# Altium schematic sheet ESP32.SchDoc
size B
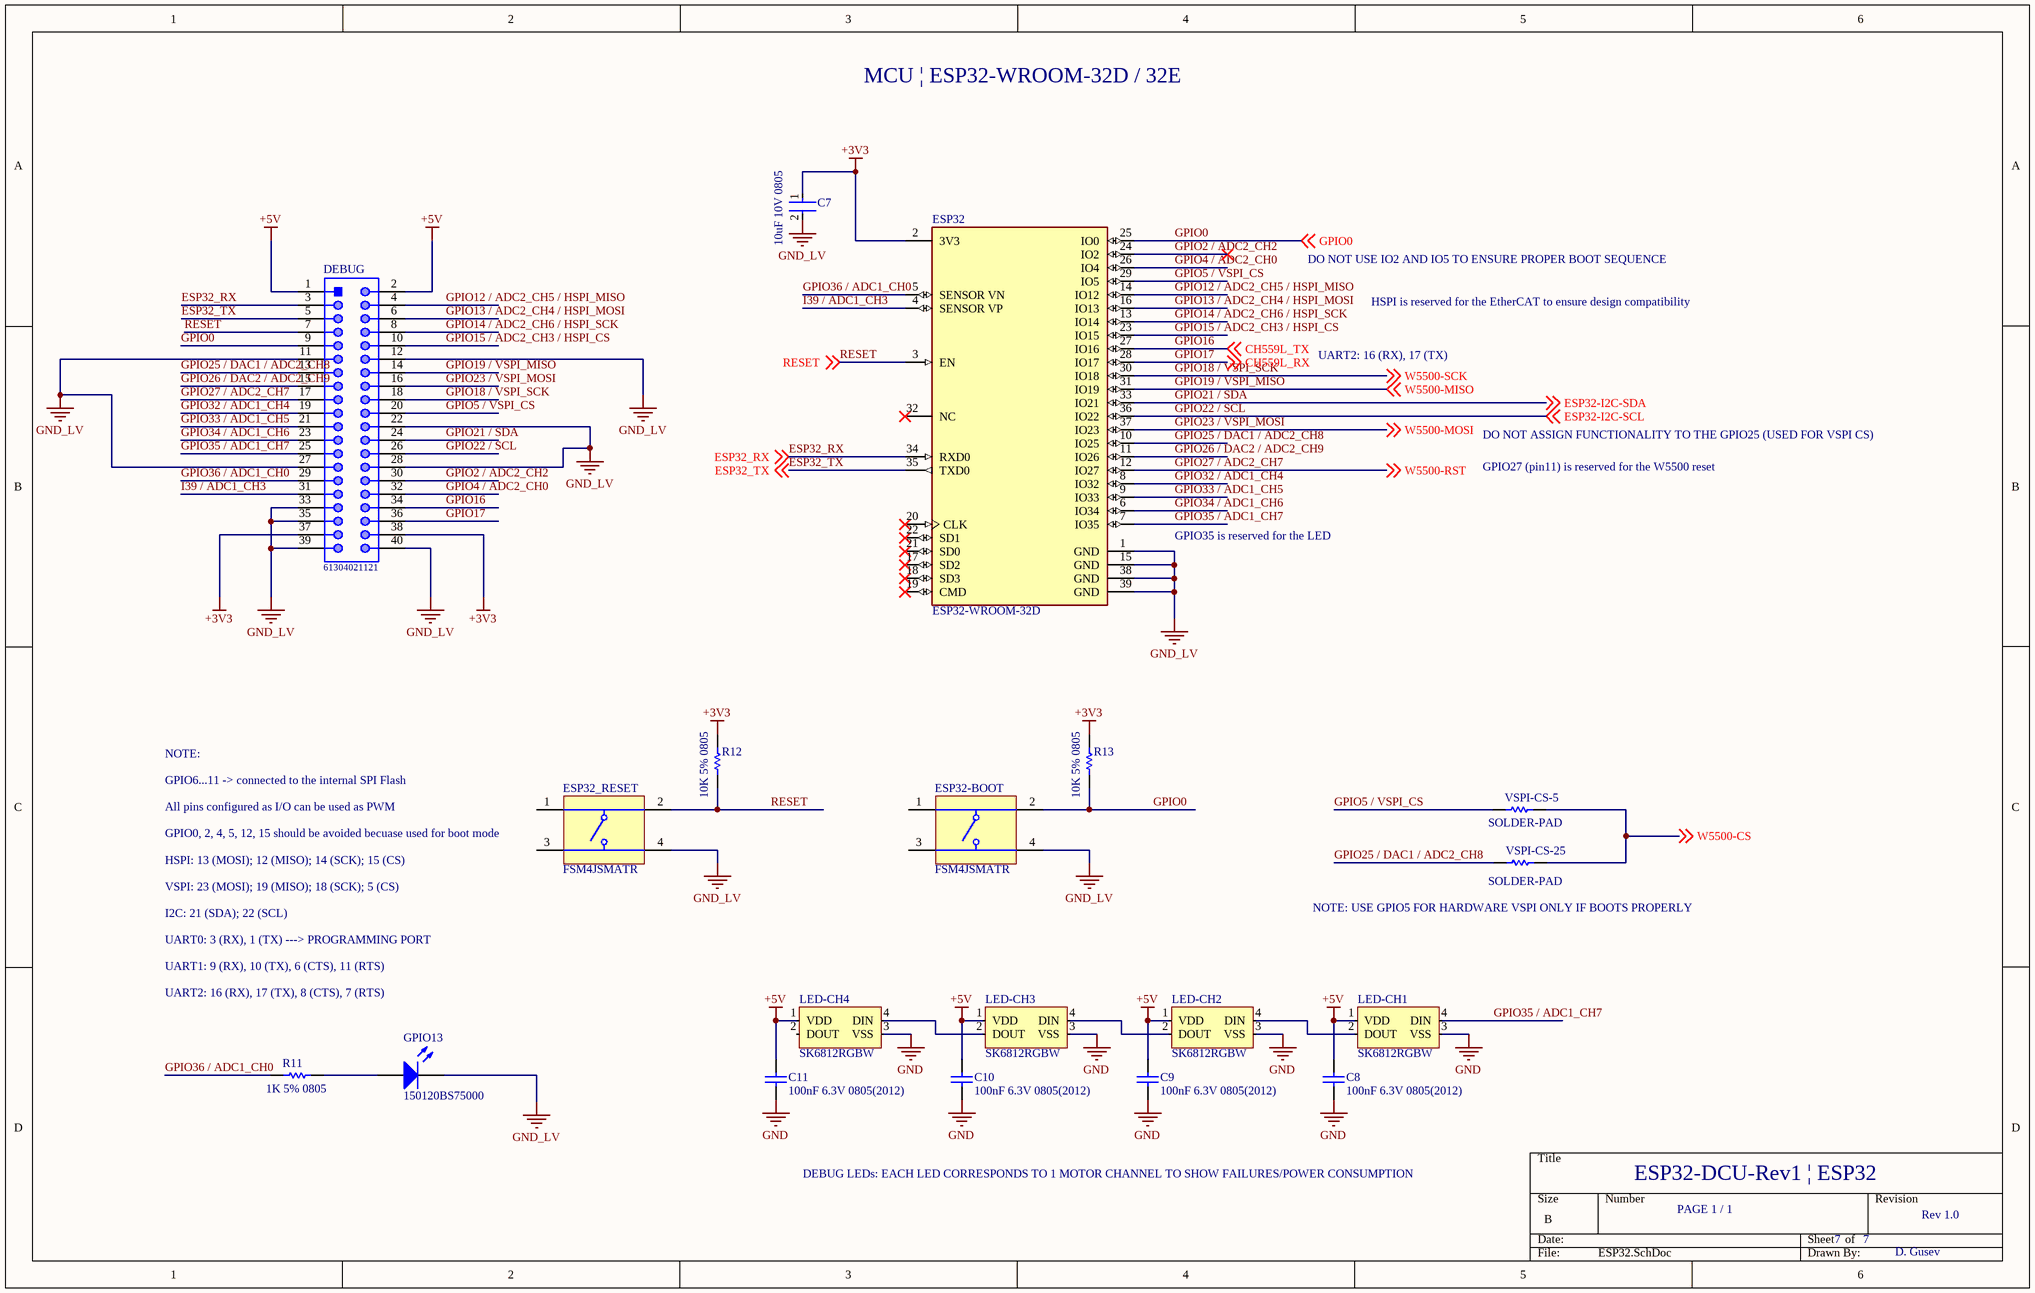
[diagram p0: ESP32.SchDoc]

## Parts
C7  10uF 10V 0805  [FP-C0805C-DG-MFG]
C8  100nF 6.3V 0805(2012)  [CAPC0805(2012)100_N]
C9  100nF 6.3V 0805(2012)  [CAPC0805(2012)100_N]
C10  100nF 6.3V 0805(2012)  [CAPC0805(2012)100_N]
C11  100nF 6.3V 0805(2012)  [CAPC0805(2012)100_N]
DEBUG  61304021121  [61304021121]
ESP32  ESP32-WROOM-32D  [FP-ESP32-WROOM-32D-MFG]
ESP32-BOOT  FSM4JSMATR  [TECO-FSM4JSMATR_V]
ESP32_RESET  FSM4JSMATR  [TECO-FSM4JSMATR_V]
GPIO13  150120BS75000  [1206_A]
LED-CH1  SK6812RGBW  [SK6812RGBW]
LED-CH2  SK6812RGBW  [SK6812RGBW]
LED-CH3  SK6812RGBW  [SK6812RGBW]
LED-CH4  SK6812RGBW  [SK6812RGBW]
R11  1K 5% 0805  [RESC2013X60X40ML20T25]
R12  10K 5% 0805  [RESC2013X60X40ML20T25]
R13  10K 5% 0805  [RESC2013X60X40ML20T25]
VSPI-CS-5  SOLDER-PAD  [RESC2013X60X35LL10T20]
VSPI-CS-25  SOLDER-PAD  [RESC2013X60X35LL10T20]

## Nets
+3V3: C7.1 DEBUG.37 DEBUG.38 ESP32.2(3V3) R12.2 R13.2
+5V: C8.2 C9.2 C10.2 C11.2 DEBUG.1 DEBUG.2 LED-CH1.1(VDD) LED-CH2.1(VDD) LED-CH3.1(VDD) LED-CH4.1(VDD)
GND: C8.1 C9.1 C10.1 C11.1 LED-CH1.3(VSS) LED-CH2.3(VSS) LED-CH3.3(VSS) LED-CH4.3(VSS)
GND_LV: C7.2 DEBUG.11 DEBUG.12 DEBUG.22 DEBUG.27 DEBUG.28 DEBUG.33 DEBUG.35 DEBUG.39 DEBUG.40 ESP32.1(GND) ESP32.15(GND) ESP32.38(GND) ESP32.39(GND) ESP32-BOOT.4 ESP32_RESET.4 GPIO13.1(K)
ESP32_RX: DEBUG.3 ESP32.34(RXD0) ; off-sheet ESP32_RX
ESP32_TX: DEBUG.5 ESP32.35(TXD0) ; off-sheet ESP32_TX
GPIO0: DEBUG.9 ESP32.25(IO0) ESP32-BOOT.2 R13.1 ; off-sheet GPIO0
GPIO2 / ADC2_CH2: DEBUG.30 ESP32.24(IO2)
GPIO4 / ADC2_CH0: DEBUG.32 ESP32.26(IO4)
GPIO5 / VSPI_CS: DEBUG.20 ESP32.29(IO5) VSPI-CS-5.1
GPIO12 / ADC2_CH5 / HSPI_MISO: DEBUG.4 ESP32.14(IO12)
GPIO13 / ADC2_CH4 / HSPI_MOSI: DEBUG.6 ESP32.16(IO13)
GPIO14 / ADC2_CH6 / HSPI_SCK: DEBUG.8 ESP32.13(IO14)
GPIO15 / ADC2_CH3 / HSPI_CS: DEBUG.10 ESP32.23(IO15)
GPIO16: DEBUG.34 ESP32.27(IO16) ; off-sheet CH559L_TX  [also labelled CH559L_TX]
GPIO17: DEBUG.36 ESP32.28(IO17) ; off-sheet CH559L_RX  [also labelled CH559L_RX]
GPIO18 / VSPI_SCK: DEBUG.18 ESP32.30(IO18) ; off-sheet W5500-SCK  [also labelled W5500-SCK]
GPIO19 / VSPI_MISO: DEBUG.14 ESP32.31(IO19) ; off-sheet W5500-MISO  [also labelled W5500-MISO]
GPIO21 / SDA: DEBUG.24 ESP32.33(IO21) ; off-sheet ESP32-I2C-SDA  [also labelled ESP32-I2C-SDA]
GPIO22 / SCL: DEBUG.26 ESP32.36(IO22) ; off-sheet ESP32-I2C-SCL  [also labelled ESP32-I2C-SCL]
GPIO23~{ }/ VSPI_MOSI: DEBUG.16 ESP32.37(IO23) ; off-sheet W5500-MOSI  [also labelled W5500-MOSI]
GPIO25 / DAC1 / ADC2_CH8: DEBUG.13 ESP32.10(IO25) VSPI-CS-25.1
GPIO26 / DAC2 / ADC2_CH9: DEBUG.15 ESP32.11(IO26)
GPIO27 / ADC2_CH7: DEBUG.17 ESP32.12(IO27) ; off-sheet W5500-RST  [also labelled W5500-RST]
GPIO32 / ADC1_CH4: DEBUG.19 ESP32.8(IO32)
GPIO33 / ADC1_CH5: DEBUG.21 ESP32.9(IO33)
GPIO34 / ADC1_CH6: DEBUG.23 ESP32.6(IO34)
GPIO35 / ADC1_CH7: DEBUG.25 ESP32.7(IO35) LED-CH1.4(DIN)
GPIO36 / ADC1_CH0: DEBUG.29 ESP32.5(SENSOR_VN) R11.1
I39 / ADC1_CH3: DEBUG.31 ESP32.4(SENSOR_VP)
RESET: DEBUG.7 ESP32.3(EN) ESP32_RESET.2 R12.1 ; off-sheet RESET
W5500-CS: VSPI-CS-5.2 VSPI-CS-25.2 ; off-sheet W5500-CS
NetGPIO13_2: GPIO13.2(A) R11.2
NetLED-CH1_2: LED-CH1.2(DOUT) LED-CH2.4(DIN)
NetLED-CH2_2: LED-CH2.2(DOUT) LED-CH3.4(DIN)
NetLED-CH3_2: LED-CH3.2(DOUT) LED-CH4.4(DIN)

Not connected (* = marked no-connect by the designer): ESP32 17(SD2)* 18(SD3)* 19(CMD)* 20(CLK)* 21(SD0)* 22(SD1)* 32(NC)*; ESP32-BOOT 1 3; ESP32_RESET 1 3; LED-CH4 2(DOUT)

## Notes on the sheet
- MCU | ESP32-WROOM-32D / 32E
- DO NOT USE IO2 AND IO5 TO ENSURE PROPER BOOT SEQUENCE
- UART2: 16 (RX), 17 (TX)
- HSPI is reserved for the EtherCAT to ensure design compatibility
- DO NOT ASSIGN FUNCTIONALITY TO THE GPIO25 (USED FOR VSPI CS)
- GPIO27 (pin11) is reserved for the W5500 reset
- GPIO35 is reserved for the LED
- NOTE:
- GPIO6...11 -> connected to the internal SPI Flash
- All pins configured as I/O can be used as PWM
- (near ESP32_RESET) GPIO0, 2, 4, 5, 12, 15 should be avoided becuase used for boot mode
- HSPI: 13 (MOSI); 12 (MISO); 14 (SCK); 15 (CS)
- VSPI: 23 (MOSI); 19 (MISO); 18 (SCK); 5 (CS)
- (near VSPI-CS-25) NOTE: USE GPIO5 FOR HARDWARE VSPI ONLY IF BOOTS PROPERLY
- I2C: 21 (SDA); 22 (SCL)
- UART0: 3 (RX), 1 (TX) ---> PROGRAMMING PORT
- UART1: 9 (RX), 10 (TX), 6 (CTS), 11 (RTS)
- UART2: 16 (RX), 17 (TX), 8 (CTS), 7 (RTS)
- DEBUG LEDs: EACH LED CORRESPONDS TO 1 MOTOR CHANNEL TO SHOW FAILURES/POWER CONSUMPTION
- ESP32-DCU-Rev1 | ESP32
- PAGE 1 / 1
- 7
- Rev 1.0
- D. Gusev

## Library data of the parts
C7 = CMP-2007-03243-2: CAP CER 10UF 10V X5R 0805; Manufacturer Part Number: C0805C106K8PACTU; Manufacturer: Kemet; 3DS Part Number: 220-00001; Tolerance: 10%; Temperature Coefficient: 15%; Material: Ceramic; Device Class L2: Capacitors; Device Class L1: Passive Components; ComponentLink2URL: https://content.kemet.com/datasheets/KEM_C1006_X5R_SMD.pdf; Height: 1.4mm; Lead Free: Yes; Digikey Description: CAP CER 10UF 10V X5R 0805; Octopart: https://octopart.com/c0805c106k8pactu-kemet-98697; Capacitance: 10uF; Value: 10uF; Temperature Range Low: -55°C; Temperature: -55°C to +85°C; Automotive: No; Mouser Description: CAP CER 10UF 10V X5R 0805; Ipc Land Pattern Name: CAPC200125X125; Temperature Range High: +85°C; Voltage: 10V; RoHS: TRUE; Device Class L3: Ceramic Capacitors; ComponentLink2Description: Datasheet; Voltage Rating: 10V; Package: C0805C-DG; Temperature Characteristic: X5R; Category: Cap
C8-C11 = CMP-1036-04392-1: CAP 100nF 6.3V ±20% 0805 (2012 Metric) Thickness 1mm SMD; Tolerance: Â±20%; Case-Metric: 2012; Case-EIA: 0805; Max Thickness: 1 mm; Technology: SMT; Value: 100nF; Rated Voltage: 6.3 V
DEBUG = CMP-1502-01135-1: THT Vertical Pin Header WR-PHD, Pitch 2.54 mm, Dual Row, 40 pins; Manufacturer: Wurth Elektronik; Contact Resistance: 20mOhm; Pitch: 2.54mm; Pin Number: 40; Withstanding Voltage: 500VAC; Gender: Male; Rated Current: 3A; Working Voltage: 250VAC; Operating Temperature: -40to105degC; Manufacturer URL: http://www.we-online.de; Orientation: Vertical; Datasheet URL: https://katalog.we-online.de/em/datasheet/6130xx21121.pdf; Package Reference: 61304021121; Row Number: Dual; Part Number: 61304021121; Packaging: Bag; Mounting Technology: THT; Publisher: WurthElektronik
ESP32 = CMP-194065-000003-1: WIFI MODULE 32MBITS SPI FLASH; Manufacturer: Espressif Systems; Max Supply Voltage: 3.6V; Nominal Supply Current: 500mA; Max Frequency: 2484MHz; Number Of Adc Channels: 16; Number Of Gpio: 32; Interface: I2C,SPI,UART,Ethernet,I2S,Other; Data Rate: 150Mbits/s; Min Supply Voltage: 3V; Bandwidth: 72MHz; Sensitivity: -98dBm; Octopart: https://octopart.com/esp32-wroom-32d-espressif+systems-91040050; Package: ESP32-WROOM-32D; ComponentLink2URL: https://www.espressif.com/sites/default/files/documentation/esp32-wroom-32d_esp32-wroom-32u_datasheet_en.pdf; Lead Free: Yes; Category: UNK; Mouser Description: Wi-Fi/BT BLE Module ESP32-D0WD, SPI Flash, UART, P; Device Class L1: Integrated Circuits (ICs); RoHS: TRUE; Temperature Range Low: -40°C; ComponentLink2Description: Datasheet; Digikey Description: WIFI MODULE 32MBITS SPI FLASH; Height: 3.2mm; Temperature: -40°C to +85°C; Manufacturer Part Number: ESP32-WROOM-32D; Device Class L3: Transceivers; Device Class L2: RF Semiconductors and Devices; Temperature Range High: +85°C; Automotive: No
ESP32-BOOT ESP32_RESET = CMP-2000-07486-1: Micro Miniature Push Button Switch FSM JSM, 50 mA, -35 to 85 degC, 4-Pin SMD, RoHS, Tape and Reel; Manufacturer: TE Connectivity; Mechanical Life: 100000Cycles; Current Rating: 50mA; Actuator Material: Polyamide; Max Voltage Rating (DC): 12V; Capacitance: 0f; Illumination Type: Illuminated; Voltage Rating (DC): 24V; Case\/Package: SMD/SMT; Operating Force: 160gf; Contact Resistance: 100mOhm; Actuator Length: 0.055inch; Switch Travel: 0.25mm; Throw Configuration: SPST; Termination: GullWing; Contact Plating: Silver; Orientation: Straight; Mounting Technology: SurfaceMount; REACH SVHC: Unknown; Electrical Life: 100000Cycles; Package Reference: FSM4JSMATR; Max Operating Temperature: 85degC; Manufacturer URL: http://www.te.com/; Package Description: 4-Pin Surface Mount Device, Body 6 x 6 mm, Pitch 4.5 mm; Datasheet Version: Rev. V, 02/2015; Packaging: TapeandReel; Min Operating Temperature: -35degC; Mount: SurfaceMount; Contact Current Rating: 50mA; Contact Material: CopperAlloy; Package Quantity: 1200; Datasheet URL: http://www.te.com/commerce/DocumentDelivery/DDEController?Action=showdoc&DocId=Customer+Drawing%7F2-1437565-7%7FV%7Fpdf%7FEnglish%7FENG_CD_2-1437565-7_V.pdf%7F4-1437565-2; RoHSCompliant: true
GPIO13 = CMP-1426-00015-1: SMD mono-color Chip LED, WL-SMCW, Blue; Manufacturer: Wuerth Elektronik; ComponentLink2Description: Datasheet; ComponentLink1URL: http://www.we-online.com; PartNumber: 150120BS75000; ComponentLink1Description: Manufacturer URL; ComponentLink2URL: http://katalog.we-online.com/led/datasheet/150120BS75000.pdf; PackageReference: 1206_A; Color: Blue
R11-R13 = CMP-2001-00590-1: Part Number: ERA6AEB123V; Manufacturer: Panasonic
VSPI-CS-5 VSPI-CS-25 = CMP-1659-00014-4: Chip Resistor, 1 Ohm, +/- 1%, 125 mW, -55 to 155 degC, 0805 (2012 Metric), RoHS, Tape and Reel; Manufacturer: Yageo; Voltage Rating: 150 V; REACH SVHC: No SVHC; Mounting Technology: Surface Mount; RoHSCompliant: true; Packaging: Tape and Reel; ComponentLink2URL: http://www.yageo.com/documents/recent/PYu-RC_Group_51_RoHS_L_04.pdf; Pins: 2; Package Quantity: 5000; DatasheetVersion: Rev. 4, 02/2016; Mount: Surface Mount; Max Operating Temperature: 155 degC; PackageDescription: 2-Pin Surface Mounted Device, Body 2 x 1.25 mm; PackageReference: 0805; Length: 2 mm; Min Operating Temperature: -55 degC; ComponentLink1URL: http://www.yageo.com/; Height: 0.5 mm; ComponentLink1Description: Manufacturer URL; ComponentLink2Description: Datasheet